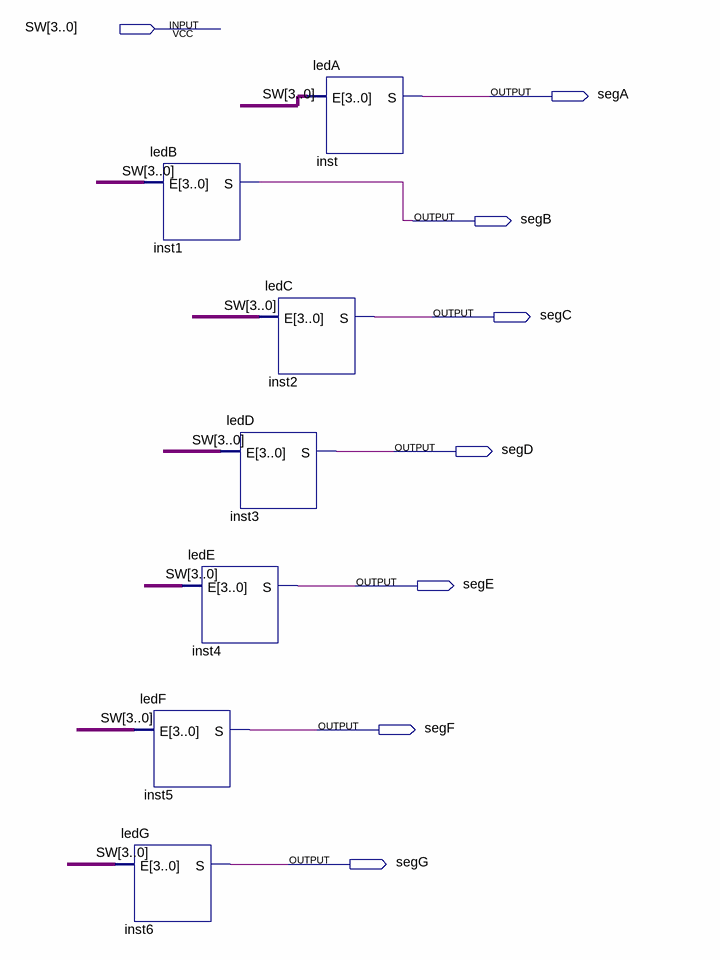
[diagram p0: schematic sheet]
// Quartus schematic display.bdf as structural Verilog: 7 symbols, 8 pins
module display (
  input  [3:0] SW,
  output segA,
  output segB,
  output segC,
  output segD,
  output segE,
  output segF,
  output segG
);

  ledF inst5 (.E(SW), .S(segF));
  ledG inst6 (.E(SW), .S(segG));
  ledB inst1 (.E(SW), .S(segB));
  ledE inst4 (.E(SW), .S(segE));
  ledC inst2 (.E(SW), .S(segC));
  ledD inst3 (.E(SW), .S(segD));
  ledA inst (.E(SW), .S(segA));
endmodule
